# Altium schematic sheet Touch Sensing.SchDoc
size A4; Revision: C.2
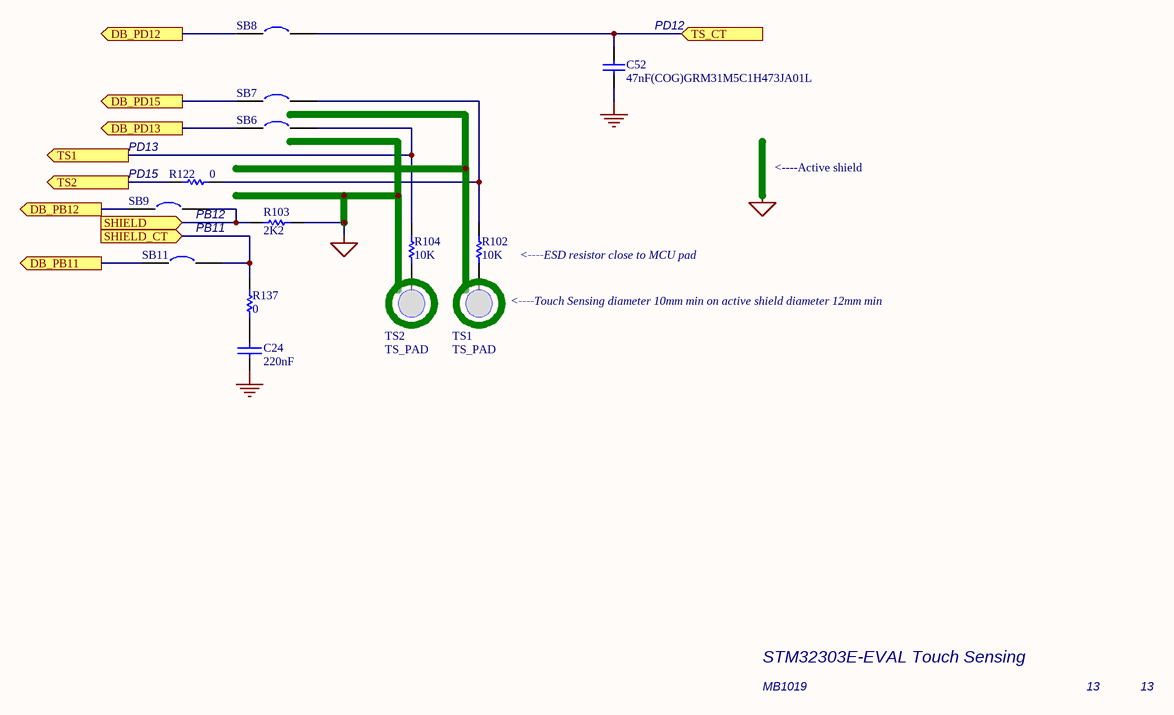
[diagram p0: Touch Sensing.SchDoc]

## Parts
C24  220nF  [0603C]
C52  47nF(COG)GRM31M5C1H473JA01L  [1206C]
R102  10K  [0603R]
R103  2K2  [0603R]
R104  10K  [0603R]
R122  0  [0603R]
R137  0  [0603R]
SB6  (no value)  [JP2_SMD]
SB7  (no value)  [JP2_SMD]
SB8  (no value)  [JP2_SMD]
SB9  (no value)  [JP2_SMD]
SB11  (no value)  [JP2_SMD]
TS1  TS_PAD  [TS_PAD]
TS2  TS_PAD  [TS_PAD]

## Ports
DB_PB11 (out), DB_PB12 (out), DB_PD12 (out), DB_PD13 (out), DB_PD15 (out), SHIELD (in), SHIELD_CT (in), TS1 (out), TS2 (out), TS_CT (in)

## Nets
GND: C24.1 C52.1
TS_SHIELD: R103.2
DB_PB11: SB11.1 ; port DB_PB11
DB_PB12: SB9.1 ; port DB_PB12
DB_PD12: SB8.1 ; port DB_PD12
DB_PD13: SB6.1 ; port DB_PD13
DB_PD15: SB7.1 ; port DB_PD15
SHIELD: R103.1 SB9.2 ; port SHIELD
SHIELD_CT: R137.1 SB11.2 ; port SHIELD_CT
TS1: R104.1 SB6.2 ; port TS1
TS2: R122.2 ; port TS2
TS_CT: C52.2 SB8.2 ; port TS_CT
NetC24_2: C24.2 R137.2
NetR102_1: R102.1 R122.1 SB7.2
NetR102_2: R102.2 TS1.1
NetR104_2: R104.2 TS2.1

## Notes on the sheet
- (near C52) PD12
- PD13
- PD15
- <----Active shield
- (near SB9) PB12
- PB11
- <----ESD resistor close to MCU pad
- <----Touch Sensing diameter 10mm min on active shield diameter 12mm min
- STM32303E-EVAL Touch Sensing
- MB1019
- 13
- STMicroelectronics
- Title:
- Number:
- Rev:
- Date:
- Sheet       of

## Library data of the parts
C24 = CAP: Capacitor
C52 = CAP: Capacitor; Value: 100pF; Published: 8-Jun-2000; Revision: July-2002: Re-released for DXP Platform.; Publisher: Altium Limited
R102-R104 R122 R137 = Res1: Resistor; Value: 1K; Published: 8-Jun-2000; Revision: July-2002: Re-released for DXP Platform.; Publisher: Altium Limited
SB6-SB9 SB11 = Circuit Breaker: Published: 24-Mar-1999; Revision: July-2002: Re-released for DXP Platform.; Publisher: Altium Limited